# EAGLE design Adafruit ESP8266 Feather (EAGLE 7.5.0)
COMPANY: ADAFRUIT INDUSTRIES; DRAWN: KTOWN; REV: B
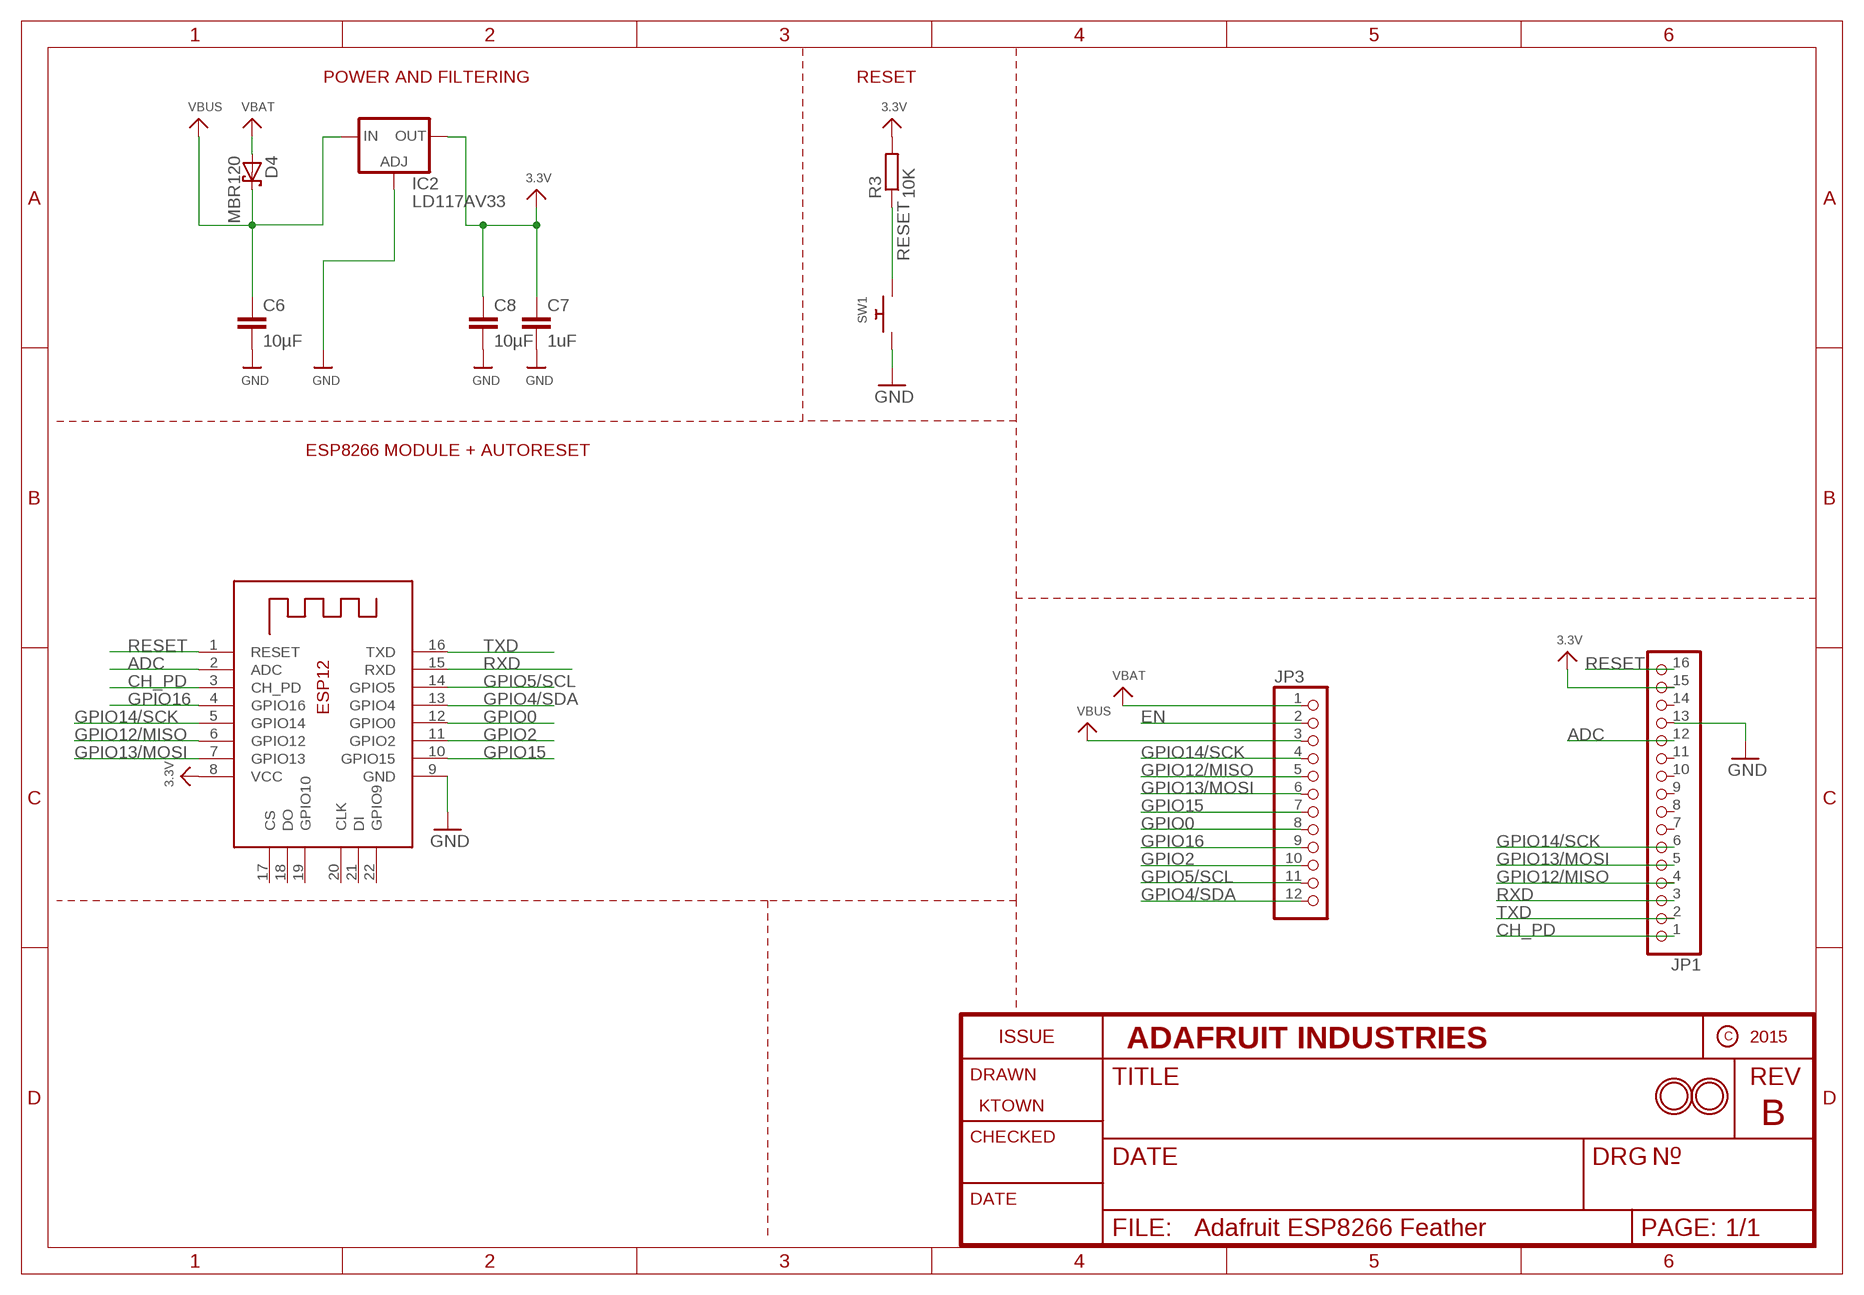
[diagram p0: schematic, sheet 1]

## Parts
C6  10µF  C-EU025-024X044  [C025-024X044]
C7  1uF  C-EU025-024X044  [C025-024X044]
C8  10µF  C-EU025-024X044  [C025-024X044]
D4  MBR120  SCHOTTKY-DIODEDO41-7  [DO41-7]
IC2  LD117AV33  [TO220L1]
JP1  HEADER-1X16ROUND  [1X16_ROUND]
JP3  HEADER-1X12  [1X12_ROUND]
R3  10K  R-EU_0204/5  [0204/5]
SW1  SWITCH_PUSHBUTTONEVQ-PE  [TACT_PANA-EVQ]
U$31  MOUNTINGHOLE2.5  [MOUNTINGHOLE_2.5_PLATED]
U$32  MOUNTINGHOLE2.5  [MOUNTINGHOLE_2.5_PLATED]
X2  ESP-12  ESP-12E  [ESP-12E]

## Nets
3.3V: C7.1 C8.1 IC2.2(OUT) JP1.15 R3.2 X2.8(VCC)
ADC: JP1.12 X2.2(ADC)
CH_PD: JP1.1 X2.3(CH_PD)
EN: JP3.2
GND: C6.2 C7.2 C8.2 IC2.1(ADJ) JP1.13 SW1.P$2 X2.9(GND)
GPIO0: JP3.8 X2.12(GPIO0)
GPIO2: JP3.10 X2.11(GPIO2)
GPIO4/SDA: JP3.12 X2.13(GPIO4)
GPIO5/SCL: JP3.11 X2.14(GPIO5)
GPIO12/MISO: JP1.4 JP3.5 X2.6(GPIO12)
GPIO13/MOSI: JP1.5 JP3.6 X2.7(GPIO13)
GPIO14/SCK: JP1.6 JP3.4 X2.5(GPIO14)
GPIO15: JP3.7 X2.10(GPIO15)
GPIO16: JP3.9 X2.4(GPIO16)
RESET: JP1.16 R3.1 SW1.P$1 X2.1(RESET)
RXD: JP1.3 X2.15(RXD)
TXD: JP1.2 X2.16(TXD)
VBAT: D4.A JP3.1
VBUS: C6.1 D4.C IC2.3(IN) JP3.3
Unconnected: JP1.7 JP1.8 JP1.9 JP1.10 JP1.11 JP1.14 X2.17(CS) X2.18(DO) X2.19(GPIO10) X2.20(CLK) X2.21(DI) X2.22(GPIO9)

## Notes on the sheet
- POWER AND FILTERING | RESET
- ESP8266 MODULE + AUTORESET

## Library data of the parts
C6-C8 = rcl:C-EU: CAPACITOR, European symbol
D4 = adafruit:SCHOTTKY-DIODE: Schottky Diode
IC2 = v-reg:LD117A?*: Low drop fixed and adjustable positive voltage regulators 1 A Source: http://www.st.com/stonline/products/literature/ds/7194/ld1117axx.pdf
JP1 = microbuilder:HEADER-1X16: PIN HEADER
JP3 = microbuilder:HEADER-1X12
R3 = rcl:R-EU_: RESISTOR, European symbol
SW1 = adafruit:SWITCH_PUSHBUTTON: Buttons SOFTTOUCHSMD_SJ - Soft touch temporary push button (Super Junk Akihabara) Compatible with SKPMANE010 [Mouser: 688-SKPMAN] C&K_KSS = Digikey: KSS221GLFS
U$31 U$32 = microbuilder:MOUNTINGHOLE: Mounting Hole For #2 screws (0.086"/2.18mm width, 0.094"/2.4mm hole) use 2.5mm; BOM: EXCLUDE
X2 = microbuilder:ESP-12E

## Board
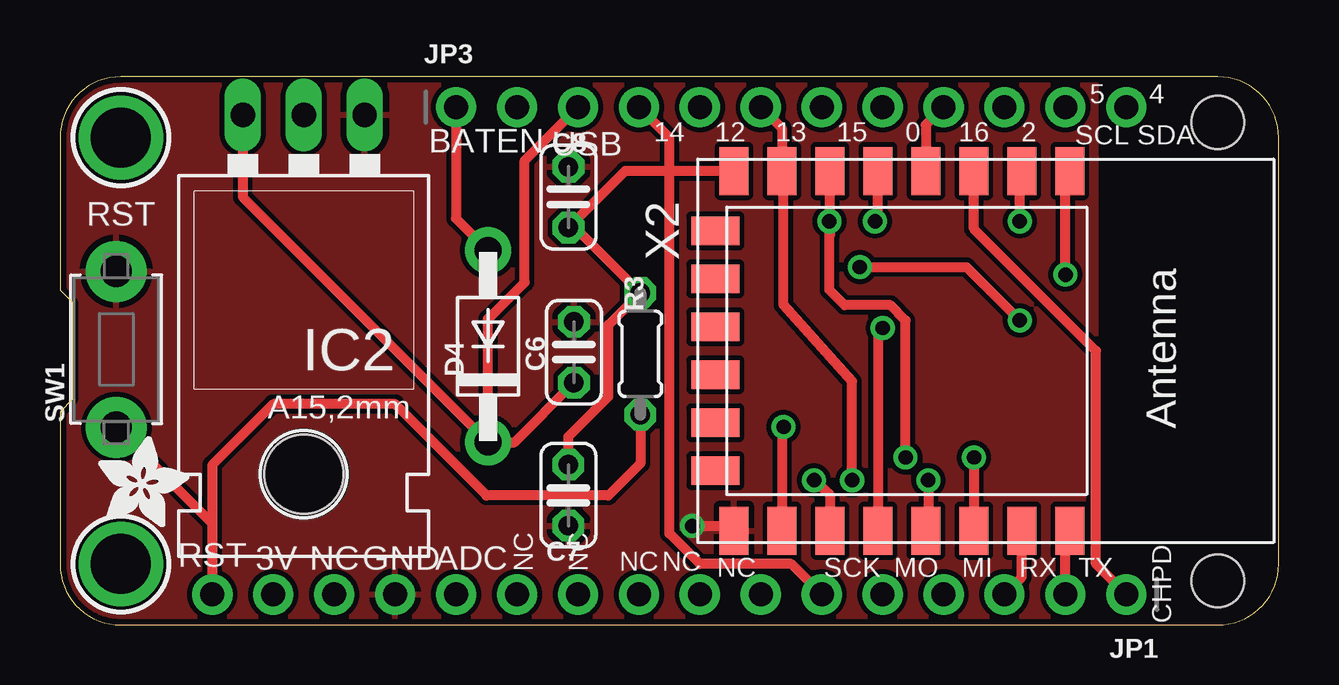
[diagram p1: board, top side]
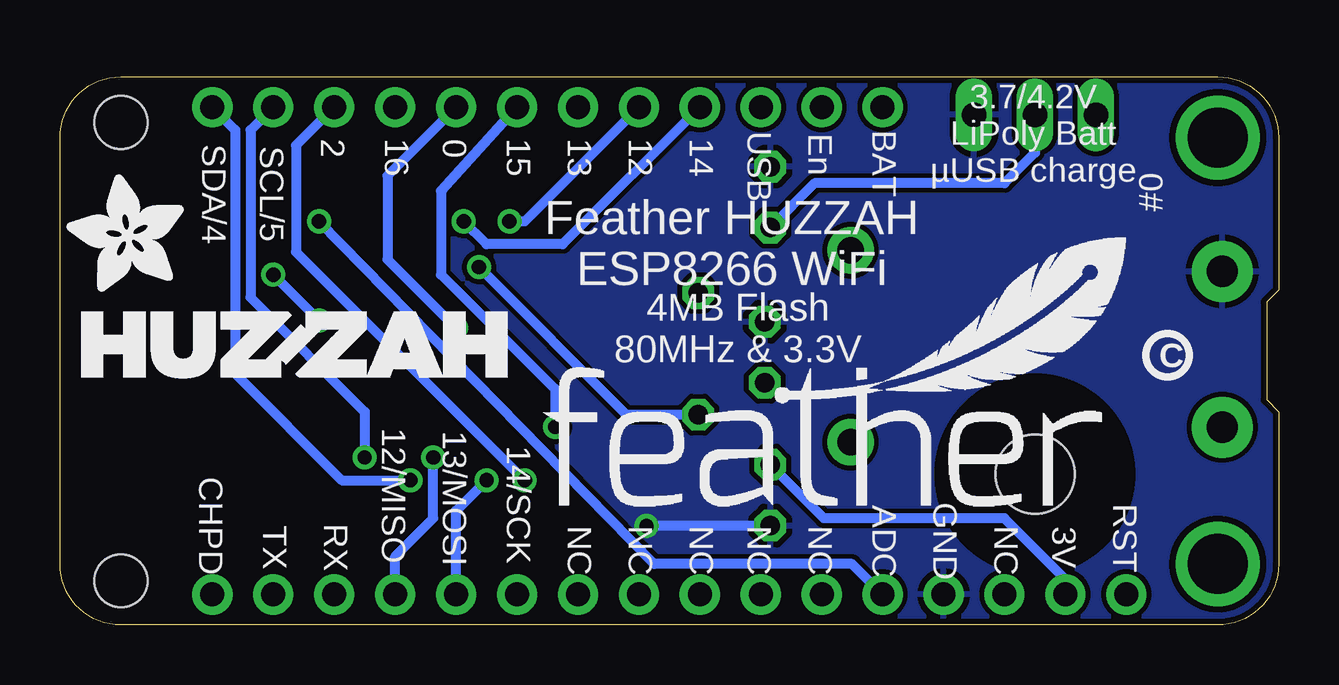
[diagram p2: board, bottom side, seen from below]

Size 50.8 x 22.86 mm. Coordinates in mm from the lower left corner, seen from the top.
Outline: 2.54,0 48.26,0 arc90 50.8,2.54 50.8,20.32 arc90 48.26,22.86 2.54,22.86 arc90 0,20.32 0,13.97 0.51,13.46 0.51,9.4 0,8.89 0,2.54 arc90 2.54,0
Copper layers (1*16): Top 0.035mm / dielectric 1.5mm / Bottom 0.035mm
Design rules "adafruit *": minimum track width 8mil, minimum drill 15.5mil, track to track 8mil, track to pad 8mil, pad to pad 8mil, via to via 8mil, smd to smd 8mil, copper to edge 10mil, drill to drill 8mil, minimum pad ring 10mil, minimum via ring 8mil, stop-mask expansion 2mil, vias tented up to drill 20mil, thermal gap 10mil
Holes 2.2 mm at 48.26,1.84 48.26,20.95

### Footprints (pad centres in the part's own frame; a part is rotated, then mirrored left to right if it is on the bottom)
C025-024X044 = drill 0.813 octagon: 1 -1.27,0; 2 1.27,0
DO41-7 = drill 1.118 pad 1.93: A 4,0; C -4,0
TO220L1 = drill 1.016 long: 1 -2.54,-3.81; 2 0,-3.81; 3 2.54,-3.81 | hole 3.302: 0,11.176
1X16_ROUND = drill 1 pad 1.676: 1 -19.05,0; 2 -16.51,0; 3 -13.97,0; 4 -11.43,0; 5 -8.89,0; 6 -6.35,0; 7 -3.81,0; 8 -1.27,0; 9 1.27,0; 10 3.81,0; 11 6.35,0; 12 8.89,0; 13 11.43,0; 14 13.97,0; 15 16.51,0; 16 19.05,0
1X12_ROUND = drill 1 pad 1.676: 1 -13.97,0; 2 -11.43,0; 3 -8.89,0; 4 -6.35,0; 5 -3.81,0; 6 -1.27,0; 7 1.27,0; 8 3.81,0; 9 6.35,0; 10 8.89,0; 11 11.43,0; 12 13.97,0
0204/5 = drill 0.813 octagon: 1 -2.54,0; 2 2.54,0
TACT_PANA-EVQ = drill 1.3 pad 2.54: P$1 -3.25,0; P$2 3.25,0
MOUNTINGHOLE_2.5_PLATED = drill 2.5 pad 3.2: P$1 0,0
ESP-12E = smd 2 x 1.2: 1 -7.5,5.77; 2 -7.5,3.77; 3 -7.5,1.77; 4 -7.5,-0.23; 5 -7.5,-2.23; 6 -7.5,-4.23; 7 -7.5,-6.23; 8 -7.5,-8.23; 9 7.5,-8.23; 10 7.5,-6.23; 11 7.5,-4.23; 12 7.5,-2.23; 13 7.5,-0.23; 14 7.5,1.77; 15 7.5,3.77; 16 7.5,5.77 | smd 1.2 x 2: 17 -5,-9; 18 -3,-9; 19 -1,-9; 20 1,-9; 21 3,-9; 22 5,-9

### Placement (x,y rotation side)
C6  21.42,11.37 90 top
C7  21.19,5.41 270 top
C8  21.19,17.84 90 top
D4  17.84,11.62 90 top
IC2  10.16,17.46 180 top
JP1  25.4,1.27 180 top
JP3  30.48,21.59 0 top
R3  24.19,11.3 90 top
SW1  2.35,11.49 90 top
U$7  [ADAFRUIT_5MM]  45.66,13.91 90 bottom
U$9  [FEATHERLOGO]  30.67,4.89 0 bottom
U$13  [PCBFEAT-REV-040]  4.64,11.24 0 bottom
U$15  [ADAFRUIT_3.5MM]  1.59,4.06 0 top
U$23  [HUZZAHLOGO]  49.91,10.29 0 bottom
U$31  2.54,20.32 270 top
U$32  2.54,2.54 270 top
X2  36.32,11.43 270 top

### Tracks (layer width: path | path; a pad name or v marks a point on that pad's centre or on a via)
3.3V
  Top 0.406: C7.1 21.19,7.86 22.86,9.53 22.86,12.51 R3.2 21.47,16.57 C8.1 23.55,18.93 X2.8
  Bottom 0.406: C8.1 19.35,18.41 11.43,18.41 10.16,19.68 IC2.2 | JP1.15 8.89,1.91 11.43,4.45 18.96,4.45 C7.1
ADC  (via drill 0.6)
  Top 0.406: v40.01,16.83 40.01,18.84 X2.2
  Bottom 0.406: JP1.12 17.78,2.54 26.04,2.54 v40.01,16.83
CH_PD
  Top 0.406: JP1.1 43.18,2.54 43.18,11.43 38.1,16.51 X2.3
GND  (via drill 0.6)
  Top 0.406: v26.35,4.13 27.89,4.13 X2.9
  Bottom 0.406: C7.2 v26.34,4.14 v26.35,4.13
  pour Top: 0,22.86 0,0 43.18,0 43.18,22.86
  pour Bottom: -0.13,0.25 43.18,0 43.18,22.86 0,22.86
GPIO0  (via drill 0.6)
  Top 0.406: v34.29,12.38 34.09,12.18 X2.12
  Bottom 0.406: JP3.8 37.15,18.73 37.15,15.24 v34.29,12.38
GPIO2  (via drill 0.6)
  Top 0.406: v31.43,6.03 32.09,5.42 X2.11
  Bottom 0.406: JP3.10 40.96,20 40.96,15.56 v31.43,6.03
GPIO4/SDA  (via drill 0.6)
  Top 0.406: v36.2,6.03 36.2,4.03 X2.13
  Bottom 0.406: JP3.12 43.5,20.64 43.5,10.48 39.05,6.03 v36.2,6.03
GPIO5/SCL  (via drill 0.6)
  Top 0.406: v38.1,6.99 38.09,6.66 X2.14
  Bottom 0.406: JP3.11 42.86,20.64 42.86,13.65 38.1,8.89 v38.1,6.99
GPIO12/MISO  (via drill 0.6)
  Top 0.406: X2.6 32.09,16.22 v32.07,16.83 32.07,13.97 32.7,13.34 34.61,13.34 35.24,12.7 v35.24,6.99
  Bottom 0.406: JP3.5 31.43,16.83 v32.07,16.83 | JP1.4 36.83,2.86 35.24,4.45 v35.24,6.99
GPIO13/MOSI  (via drill 0.6)
  Top 0.406: JP3.6 30.09,20.71 X2.7 30.16,18.86 30.16,13.34 33.02,10.16 v33.02,6.03
  Bottom 0.406: JP1.5 34.29,4.76 v33.02,6.03
GPIO14/SCK  (via drill 0.6)
  Top 0.406: v33.97,16.83 34.09,16.95 X2.5 | JP1.6 30.48,2.54 26.67,2.54 25.4,3.81 25.4,20.32 JP3.4
  Bottom 0.406: JP3.4 29.84,15.88 33.02,15.88 v33.97,16.83
GPIO15  (via drill 0.6)
  Top 0.406: v30.16,8.26 30.09,8.18 X2.10
  Bottom 0.406: JP3.7 34.92,18.1 34.92,14.61 30.16,9.84 v30.16,8.26
GPIO16
  Top 0.406: JP3.9 36.09,20.85 X2.4
RESET  (via drill 0.6)
  Top 0.406: SW1.P$1 6.35,4.24 | R3.1 24.19,6.73 22.86,5.4 17.78,5.4 13.97,9.21 8.89,9.21 6.35,6.67 6.35,4.24 | 6.35,4.24 JP1.16 | v33.34,14.92 37.78,14.92 v40.01,12.7 | v41.91,14.61 41.91,18.75 X2.1
  Bottom 0.406: R3.1 27.18,8.76 v33.34,14.92 | v40.01,12.7 v41.91,14.61
RXD
  Top 0.406: JP1.3 40.09,1.99 X2.15
TXD
  Top 0.406: JP1.2 41.91,3.75 X2.16
VBAT
  Top 0.406: JP3.1 16.51,16.95 D4.A
VBUS
  Top 0.406: D4.C 18.94,7.62 C6.1 | D4.C 17.84,12.76 19.37,14.29 19.37,19.37 JP3.3 | IC2.3 7.62,17.84 D4.C

### Text on the board
tPlace: 5 | 4 | 14 | 12 | 13 | 15 | 0 | 16 | 2 | BAT | EN | USB | SCL | SDA | RST | RST | 3V | NC | GND | ADC | NC | NC | NC | NC | NC | SCK | MO | MI | RX | TX | CHPD
bPlace: 3.7/4.2V / LiPoly Batt / µUSB charge | En | 0 | 2 | BAT | USB | 14 | 12 | 13 | 15 | 16 | #0 | SCL/5 | SDA/4 | Feather HUZZAH / ESP8266 WiFi | 4MB Flash / 80MHz & 3.3V | 14/SCK | 13/MOSI | 12/MISO | RST | CHPD | 3V | NC | GND | ADC | NC | NC | NC | NC | NC | RX | TX